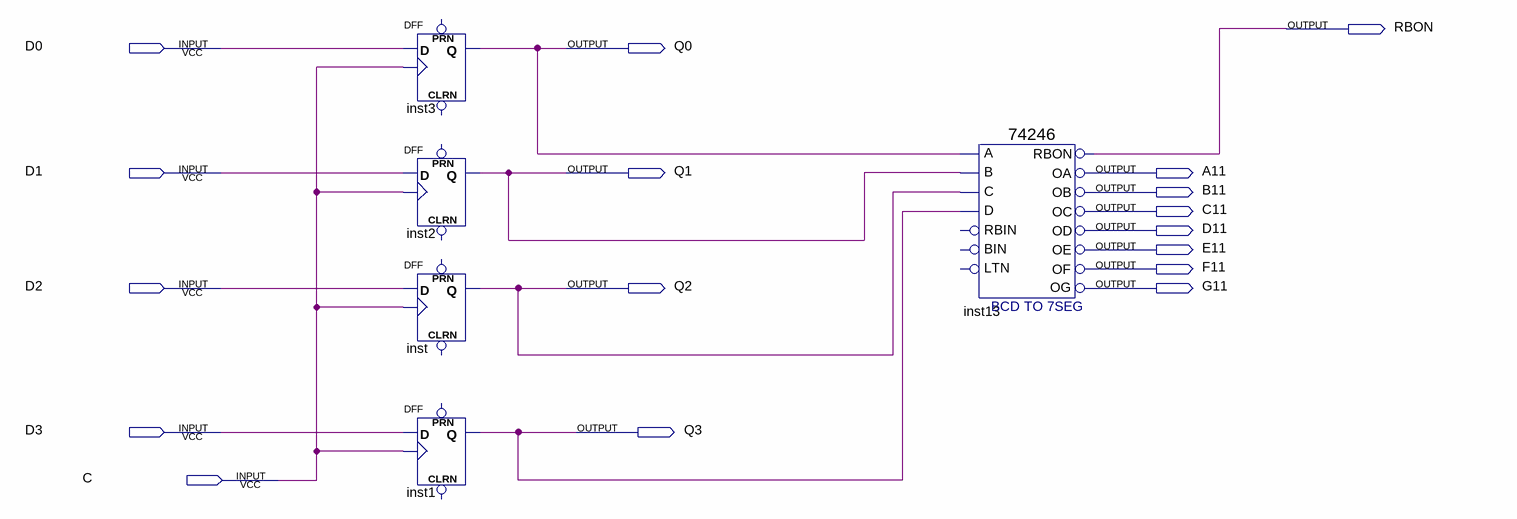
[diagram p0: schematic sheet]
// Quartus schematic Register.bdf as structural Verilog: 5 symbols, 17 pins
module Register (
  input  D0,
  input  D1,
  input  D2,
  input  D3,
  input  C,
  output RBON,
  output Q0,
  output Q1,
  output A11,
  output B11,
  output C11,
  output D11,
  output E11,
  output F11,
  output Q2,
  output G11,
  output Q3
);

  DFF inst3 (.CLK(C), .D(D0), .Q(Q0));  // open: CLRN, PRN
  DFF inst2 (.CLK(C), .D(D1), .Q(Q1));  // open: CLRN, PRN
  DFF inst (.CLK(C), .D(D2), .Q(Q2));  // open: CLRN, PRN
  DFF inst1 (.CLK(C), .D(D3), .Q(Q3));  // open: CLRN, PRN
  \74246  inst13 (
    .B(Q1), .A(Q0), .D(Q3), .C(Q2), .OD(D11), .RBON(RBON), .OC(C11), .OB(B11), .OE(E11), .OF(F11), .OA(A11),
    .OG(G11));  // open: RBIN, LTN, BIN
endmodule
